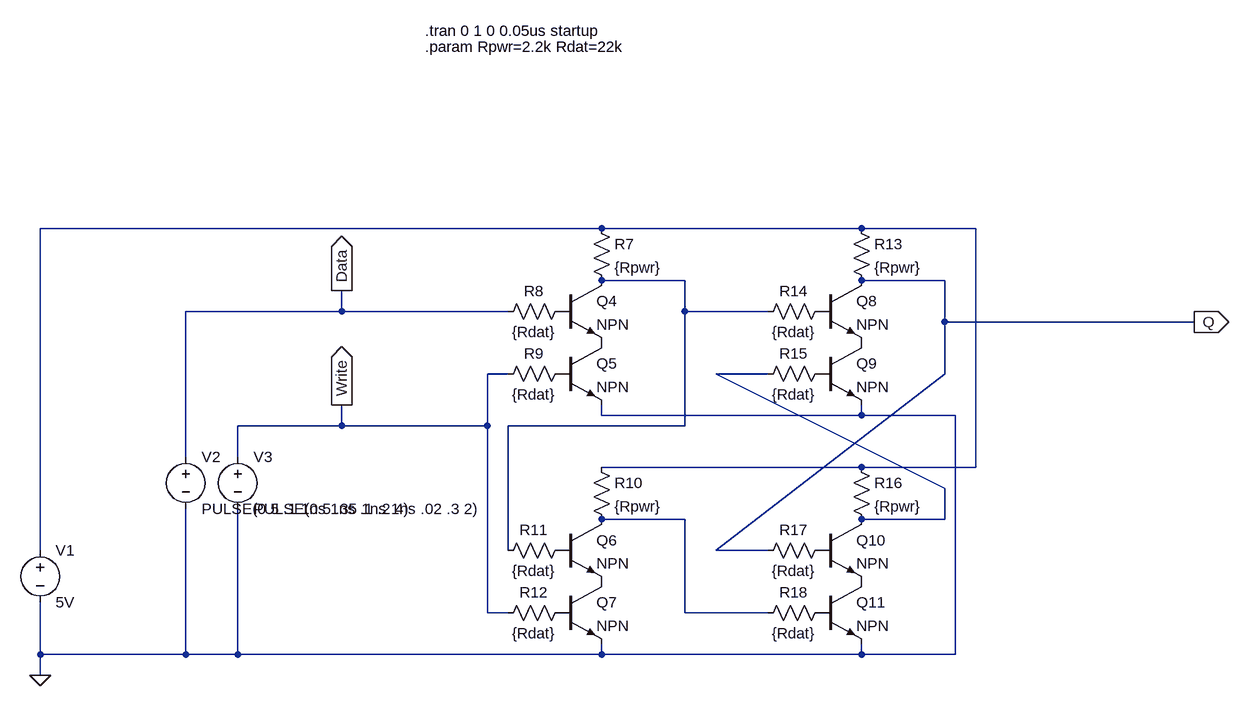
[diagram p0: schematic Counter.asc]
Counter.asc, the LTspice schematic file:
Version 4.1
SHEET 1 4532 1588
WIRE 1248 96 384 96
WIRE 1648 96 1248 96
WIRE 1824 96 1648 96
WIRE 1376 176 1248 176
WIRE 1776 176 1648 176
WIRE 848 224 848 192
WIRE 848 224 608 224
WIRE 1104 224 848 224
WIRE 1376 224 1376 176
WIRE 1504 224 1376 224
WIRE 1776 240 1776 176
WIRE 2160 240 1776 240
WIRE 1104 320 1072 320
WIRE 1504 320 1424 320
WIRE 1776 320 1776 240
WIRE 1248 384 1248 368
WIRE 1648 384 1648 368
WIRE 1648 384 1248 384
WIRE 1792 384 1648 384
WIRE 848 400 848 368
WIRE 848 400 688 400
WIRE 1072 400 1072 320
WIRE 1072 400 848 400
WIRE 1376 400 1376 224
WIRE 1376 400 1104 400
WIRE 608 448 608 224
WIRE 688 448 688 400
WIRE 1648 464 1248 464
WIRE 1824 464 1824 96
WIRE 1824 464 1648 464
WIRE 1776 496 1424 320
WIRE 1376 544 1248 544
WIRE 1776 544 1776 496
WIRE 1776 544 1648 544
WIRE 384 592 384 96
WIRE 1104 592 1104 400
WIRE 1424 592 1776 320
WIRE 1504 592 1424 592
WIRE 1072 688 1072 400
WIRE 1104 688 1072 688
WIRE 1376 688 1376 544
WIRE 1504 688 1376 688
WIRE 384 752 384 672
WIRE 608 752 608 528
WIRE 608 752 384 752
WIRE 688 752 688 528
WIRE 688 752 608 752
WIRE 1248 752 1248 736
WIRE 1248 752 688 752
WIRE 1648 752 1648 736
WIRE 1648 752 1248 752
WIRE 1792 752 1792 384
WIRE 1792 752 1648 752
WIRE 384 784 384 752
FLAG 384 784 0
FLAG 848 192 Data
IOPIN 848 192 Out
FLAG 848 368 Write
IOPIN 848 368 Out
FLAG 2160 240 Q
IOPIN 2160 240 Out
SYMBOL npn 1184 176 R0
SYMATTR InstName Q4
SYMBOL res 1232 80 R0
SYMATTR InstName R7
SYMATTR Value {Rpwr}
SYMBOL res 1088 240 R270
WINDOW 0 32 56 VTop 2
WINDOW 3 0 56 VBottom 2
SYMATTR InstName R8
SYMATTR Value {Rdat}
SYMBOL npn 1184 272 R0
SYMATTR InstName Q5
SYMBOL res 1088 336 R270
WINDOW 0 32 56 VTop 2
WINDOW 3 0 56 VBottom 2
SYMATTR InstName R9
SYMATTR Value {Rdat}
SYMBOL npn 1184 544 R0
SYMATTR InstName Q6
SYMBOL res 1232 448 R0
SYMATTR InstName R10
SYMATTR Value {Rpwr}
SYMBOL res 1088 608 R270
WINDOW 0 32 56 VTop 2
WINDOW 3 0 56 VBottom 2
SYMATTR InstName R11
SYMATTR Value {Rdat}
SYMBOL npn 1184 640 R0
SYMATTR InstName Q7
SYMBOL res 1088 704 R270
WINDOW 0 32 56 VTop 2
WINDOW 3 0 56 VBottom 2
SYMATTR InstName R12
SYMATTR Value {Rdat}
SYMBOL npn 1584 176 R0
SYMATTR InstName Q8
SYMBOL res 1632 80 R0
SYMATTR InstName R13
SYMATTR Value {Rpwr}
SYMBOL res 1488 240 R270
WINDOW 0 32 56 VTop 2
WINDOW 3 0 56 VBottom 2
SYMATTR InstName R14
SYMATTR Value {Rdat}
SYMBOL npn 1584 272 R0
SYMATTR InstName Q9
SYMBOL res 1488 336 R270
WINDOW 0 32 56 VTop 2
WINDOW 3 0 56 VBottom 2
SYMATTR InstName R15
SYMATTR Value {Rdat}
SYMBOL npn 1584 544 R0
SYMATTR InstName Q10
SYMBOL res 1632 448 R0
SYMATTR InstName R16
SYMATTR Value {Rpwr}
SYMBOL res 1488 608 R270
WINDOW 0 32 56 VTop 2
WINDOW 3 0 56 VBottom 2
SYMATTR InstName R17
SYMATTR Value {Rdat}
SYMBOL npn 1584 640 R0
SYMATTR InstName Q11
SYMBOL res 1488 704 R270
WINDOW 0 32 56 VTop 2
WINDOW 3 0 56 VBottom 2
SYMATTR InstName R18
SYMATTR Value {Rdat}
SYMBOL voltage 384 576 R0
WINDOW 123 0 0 Left 0
WINDOW 39 0 0 Left 0
SYMATTR InstName V1
SYMATTR Value 5V
SYMBOL voltage 608 432 R0
WINDOW 123 0 0 Left 0
WINDOW 39 0 0 Left 0
SYMATTR InstName V2
SYMATTR Value PULSE(0 5 .1 1ns 1ns .1 .2 4)
SYMBOL voltage 688 432 R0
WINDOW 123 0 0 Left 0
WINDOW 39 0 0 Left 0
SYMATTR InstName V3
SYMATTR Value PULSE(0 5 .35 1ns 1ns .02 .3 2)
TEXT 976 -184 Left 2 !.param Rpwr=2.2k Rdat=22k
TEXT 976 -208 Left 2 !.tran 0 1 0 0.05us startup

The netlist it stands for:
* Counter.asc
Q4 N002 P001 P002 0 NPN
R7 N001 N002 {Rpwr}
R8 Data P001 {Rdat}
Q5 P002 P003 0 0 NPN
R9 Write P003 {Rdat}
Q6 N004 P004 P005 0 NPN
R10 N001 N004 {Rpwr}
R11 N002 P004 {Rdat}
Q7 P005 P006 0 0 NPN
R12 Write P006 {Rdat}
Q8 Q P007 P008 0 NPN
R13 N001 Q {Rpwr}
R14 N002 P007 {Rdat}
Q9 P008 P009 0 0 NPN
R15 N003 P009 {Rdat}
Q10 N003 P010 P011 0 NPN
R16 N001 N003 {Rpwr}
R17 Q P010 {Rdat}
Q11 P011 P012 0 0 NPN
R18 N004 P012 {Rdat}
V1 N001 0 5V
V2 Data 0 PULSE(0 5 .1 1ns 1ns .1 .2 4)
V3 Write 0 PULSE(0 5 .35 1ns 1ns .02 .3 2)
.model NPN NPN
.model PNP PNP
.lib standard.bjt
.param Rpwr=2.2k Rdat=22k
.tran 0 1 0 0.05us startup
.backanno
.end